# EAGLE design mechanical-endstop (EAGLE 5.10)
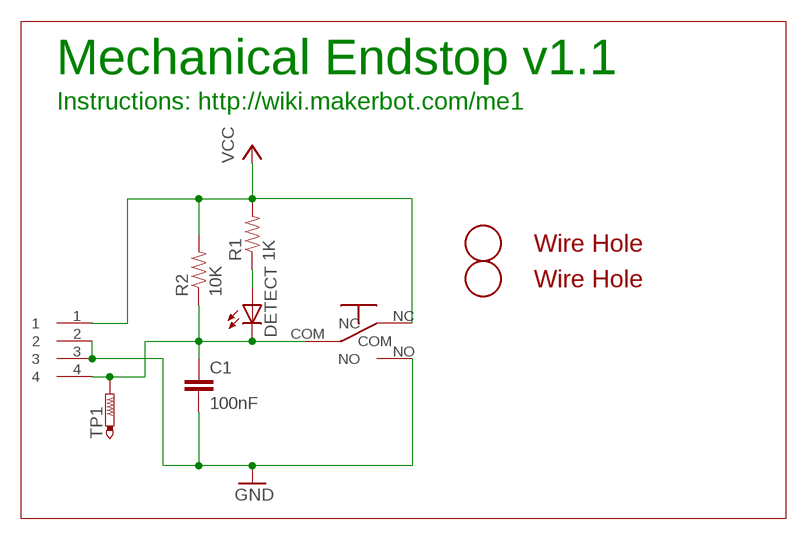
[diagram p0: schematic, sheet 1]

## Parts
C1  100nF  CAP0805  [0805]
DETECT  LED0805  [LED-0805]
R1  1K  RESISTOR  [0805]
R2  10K  RESISTOR  [0805]
TP1  PTR1TP09R  [TP09R]
U$1  CDROM  [70553-04]
U$2  OMRON-D2FA  [OMRON-D2F-A]
U$5  3MMHOLE  [3MMHOLE]
U$6  3MMHOLE  [3MMHOLE]

## Nets
GND: C1.2 U$1.2 U$1.3 U$2.NO
N$1: DETECT.A R1.1
N$2: C1.1 DETECT.C R2.1 TP1.TP U$1.4 U$2.COM
VCC: R1.2 R2.2 U$1.1 U$2.NC

## Notes on the sheet
- Mechanical Endstop v1.1
- Instructions: http://wiki.makerbot.com/me1

## Library data of the parts
C1 = SparkFun:CAP: Capacitor Standard 0603 ceramic capacitor, and 0.1" leaded capacitor.
DETECT = SparkFun:LED: LEDs Standard schematic elements and footprints for 5mm, 3mm, 1206, and 0603 sized LEDs. 5mm - Spark Fun Electronics SKU : COM-00529 (and others)
R1 R2 = SparkFun:RESISTOR: Resistor Basic schematic elements and footprints for 0603, 1206, and PTH 1/10th watt (small) resistors.
TP1 = testpad:PTR1: TEST PIN
U$1 = reprap:CDROM
U$2 = reprap:OMRON-D2F
U$5 U$6 = reprap:3MMHOLE

## Net classes
0 default: width 0.813 mm, drill 0.635 mm, clearance 0.635 mm

## Board
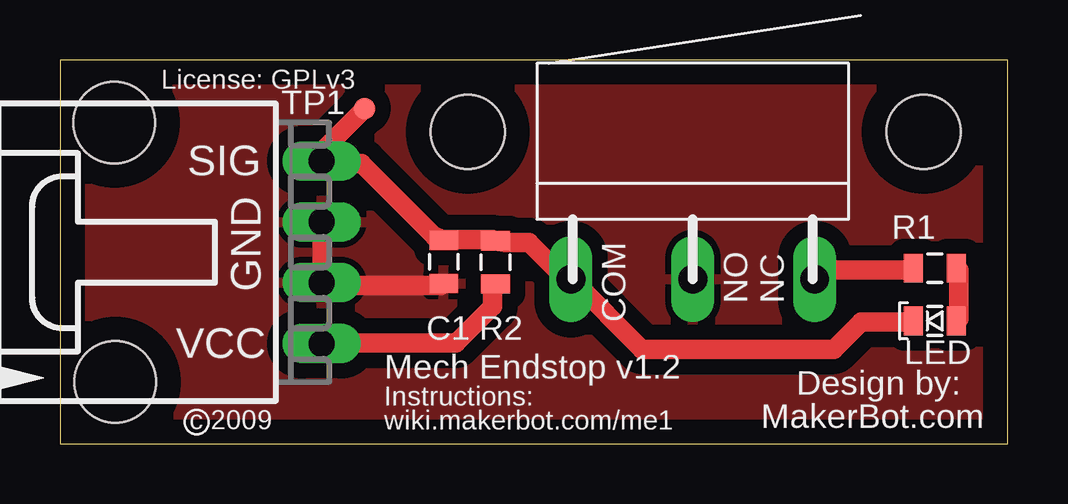
[diagram p1: board, top side]
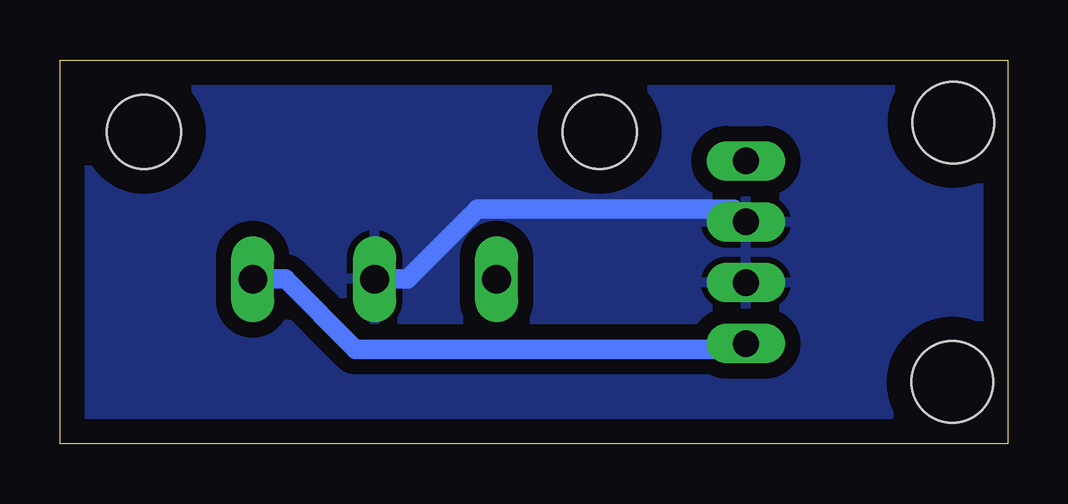
[diagram p2: board, bottom side, seen from below]

Size 39.5 x 16 mm. Coordinates in mm from the lower left corner, seen from the top.
Outline: 0,0 39.5,0 39.5,16 0,16 0,0
Copper layers (1*16): Top 0.035mm / dielectric 1.5mm / Bottom 0.035mm
Design rules "default": minimum track width 10mil, minimum drill 24mil, track to track 8mil, track to pad 8mil, pad to pad 8mil, via to via 8mil, smd to smd 8mil, copper to edge 40mil, drill to drill 8mil, minimum pad ring 10mil, minimum via ring 8mil, stop-mask expansion 4mil, vias tented up to drill 0mil, thermal gap 10mil

### Footprints (pad centres in the part's own frame; a part is rotated, then mirrored left to right if it is on the bottom)
0805 = smd 0.8 x 1.2: 1 -0.9,0; 2 0.9,0
LED-0805 = smd 1.2 x 0.8: A 0,-0.9; C 0,0.9
TP09R = smd 0.9 x 0.9: TP 0,0
70553-04 = drill 1.092 long: 1 -3.81,-7.62; 2 -1.27,-7.62; 3 1.27,-7.62; 4 3.81,-7.62 | hole 3.4: -5.41,0.98; 5.41,1.02
OMRON-D2F-A = drill 1.2 long: COM -5.08,0; NC 5.08,0; NO 0,0
3MMHOLE = hole 3.1: 0,0

### Placement (x,y rotation side)
C1  16,7.58 270 top
DETECT  36.47,5.12 90 top
R1  36.47,7.32 180 top
R2  18.16,7.56 270 top
TP1  12.7,13.97 0 top
U$1  3.29,7.98 90 top
U$2  26.38,6.86 0 top
U$5  17,13 0 top
U$6  36,13 0 top

### Tracks (layer width: path | path; a pad name or v marks a point on that pad's centre or on a via)
GND
  Top 0.813: C1.2 15.88,6.6 10.92,6.6 U$1.2 10.92,7.11 10.92,9.14 U$1.3
  Bottom 0.813: U$2.NO 25.02,6.86 22.1,9.78 11.43,9.78 10.92,9.27 U$1.3
  pour Top: -1.27,16.51 40.64,16.51 40.64,-1.27 -1.27,-1.27
  pour Bottom: -1.27,16.51 40.64,16.51 40.64,-1.27 -1.27,-1.27
N$1
  Top 0.813: DETECT.A 37.47,5.21 37.47,7.24 R1.1
N$2
  Top 0.813: DETECT.C 35.31,5.08 33.4,5.08 32.26,3.94 24.26,3.94 21.34,6.86 U$2.COM 20.95,6.99 19.56,8.38 18.54,8.38 R2.1 18.03,8.51 16,8.51 C1.1 15.62,8.64 12.57,11.68 10.92,11.68 U$1.4 10.92,12.19 TP1.TP
VCC
  Top 0.813: R1.2 35.43,7.24 31.88,7.24 31.5,6.86 U$2.NC | R2.2 18.03,6.6 18.03,5.71 16.51,4.19 10.92,4.19 U$1.1
  Bottom 0.813: U$2.NC 30.1,6.86 27.18,3.94 11.05,3.94 10.92,4.06 U$1.1

### Text on the board
tPlace: License: GPLv3 | SIG | GND | VCC | Mech Endstop v1.2 | LED | Instructions: | Design by: | c 2009 | wiki.makerbot.com/me1 | MakerBot.com